# Altium project breakout_brd_raton_v0.PrjPcb
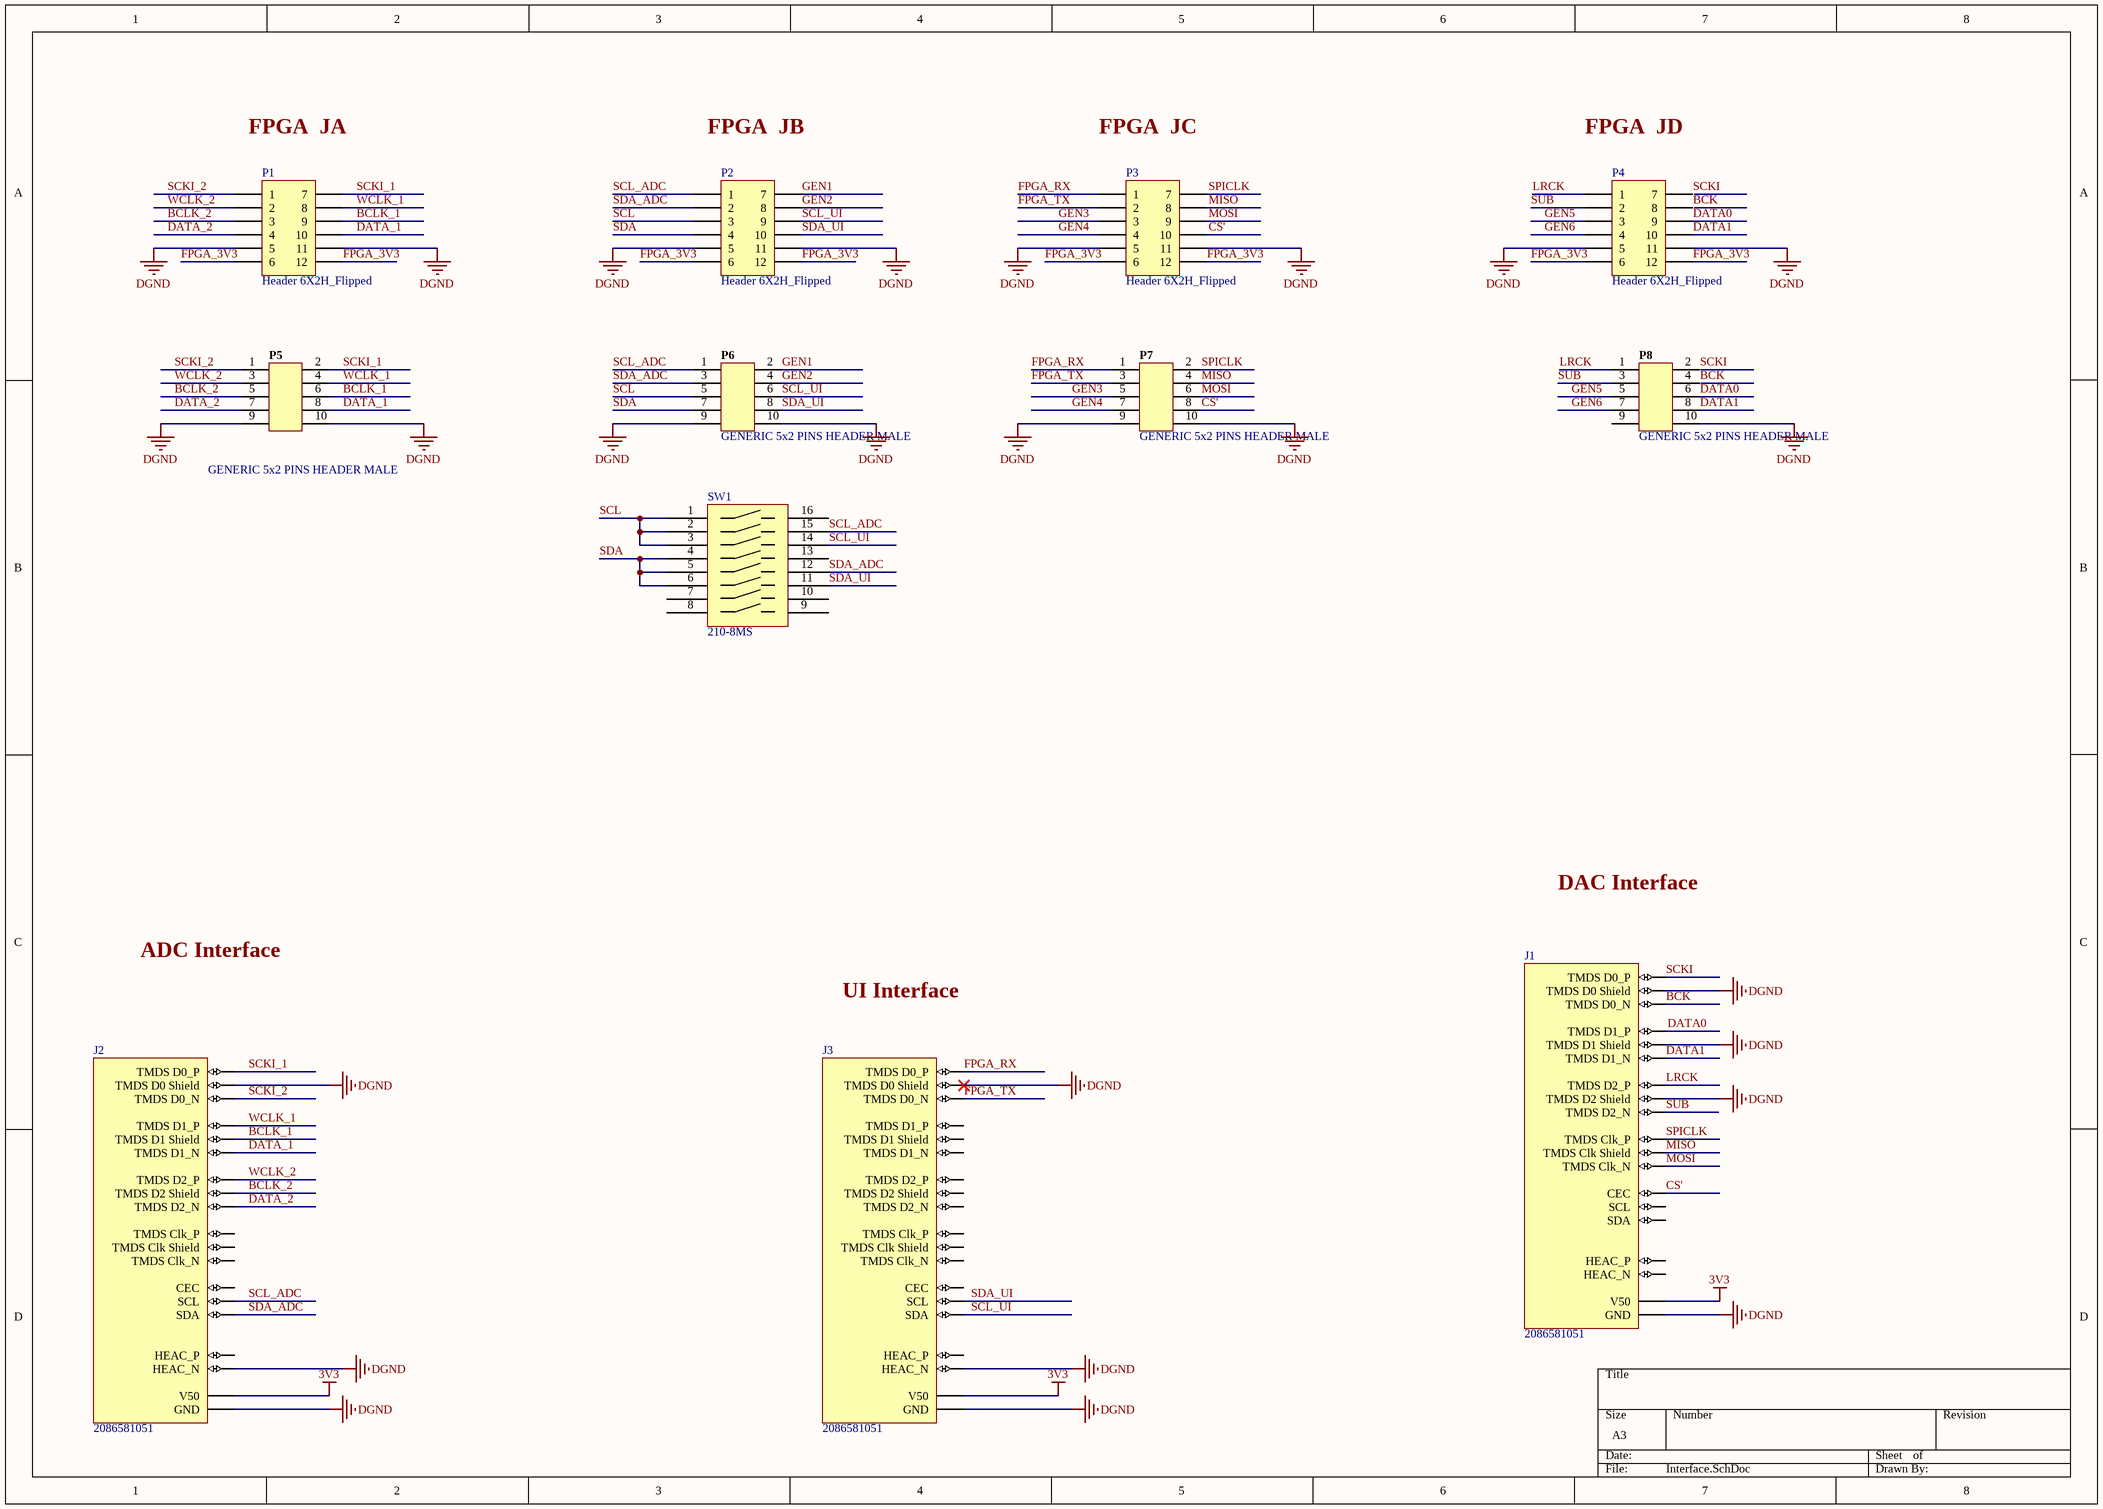
[diagram p0: Interface.SchDoc]
1 sheet, 12 parts. Net scope: global (net labels, ports and power ports of the same name join across sheets).
Board file: breakout_brd_v0.PcbDoc

## Sheet Interface.SchDoc
size A3

### Parts
J1  2086581051  [2086581051]
J2  2086581051  [2086581051]
J3  2086581051  [2086581051]
P1  Header 6X2H_Flipped  [HDR2X6H_Flipped]
P2  Header 6X2H_Flipped  [HDR2X6H_Flipped]
P3  Header 6X2H_Flipped  [HDR2X6H_Flipped]
P4  Header 6X2H_Flipped  [HDR2X6H_Flipped]
P5  GENERIC 5x2 PINS HEADER MALE  [GENERIC 5PIN 2ROW HEADER 0]
P6  GENERIC 5x2 PINS HEADER MALE  [GENERIC 5PIN 2ROW HEADER 0]
P7  GENERIC 5x2 PINS HEADER MALE  [GENERIC 5PIN 2ROW HEADER 0]
P8  GENERIC 5x2 PINS HEADER MALE  [GENERIC 5PIN 2ROW HEADER 0]
SW1  210-8MS  [210-8MS]

### Nets
3V3: J1.18(V50) J2.18(V50) J3.18(V50)
DGND: J1.2(TMDS_D2_Shield) J1.5(TMDS_D1_Shield) J1.8(TMDS_D0_Shield) J1.17(GND) J2.8(TMDS_D0_Shield) J2.17(GND) J2.19(HEAC_N) J3.8(TMDS_D0_Shield) J3.17(GND) J3.19(HEAC_N) P1.5 P1.11 P2.5 P2.11 P3.5 P3.11 P4.5 P4.11 P5.9 P5.10 P6.9 P6.10 P7.9 P7.10 P8.10
BCK: J1.9(TMDS_D0_N) P4.8 P8.4
BCLK_1: J2.5(TMDS_D1_Shield) P1.9 P5.6
BCLK_2: J2.2(TMDS_D2_Shield) P1.3 P5.5
CS': J1.13(CEC) P3.10 P7.8
DATA0: J1.4(TMDS_D1_P) P4.9 P8.6
DATA1: J1.6(TMDS_D1_N) P4.10 P8.8
DATA_1: J2.6(TMDS_D1_N) P1.10 P5.8
DATA_2: J2.3(TMDS_D2_N) P1.4 P5.7
FPGA_3V3: P1.6 P1.12 P2.6 P2.12 P3.6 P3.12 P4.6 P4.12
FPGA_RX: J3.7(TMDS_D0_P) P3.1 P7.1
FPGA_TX: J3.9(TMDS_D0_N) P3.2 P7.3
GEN1: P2.7 P6.2
GEN2: P2.8 P6.4
GEN3: P3.3 P7.5
GEN4: P3.4 P7.7
GEN5: P4.3 P8.5
GEN6: P4.4 P8.7
LRCK: J1.1(TMDS_D2_P) P4.1 P8.1
MISO: J1.11(TMDS_Clk_Shield) P3.8 P7.4
MOSI: J1.12(TMDS_Clk_N) P3.9 P7.6
SCKI: J1.7(TMDS_D0_P) P4.7 P8.2
SCKI_1: J2.7(TMDS_D0_P) P1.7 P5.2
SCKI_2: J2.9(TMDS_D0_N) P1.1 P5.1
SCL: P2.3 P6.5 SW1.1(SW1) SW1.2(SW2) SW1.3(SW3)
SCL_ADC: J2.15(SCL) P2.1 P6.1 SW1.15(SW2.in)
SCL_UI: J3.16(SDA) P2.9 P6.6 SW1.14(SW3.in)
SDA: P2.4 P6.7 SW1.4(SW4) SW1.5(SW1) SW1.6(SW2)
SDA_ADC: J2.16(SDA) P2.2 P6.3 SW1.12(SW1.in)
SDA_UI: J3.15(SCL) P2.10 P6.8 SW1.11(SW2.in)
SPICLK: J1.10(TMDS_Clk_P) P3.7 P7.2
SUB: J1.3(TMDS_D2_N) P4.2 P8.3
WCLK_1: J2.4(TMDS_D1_P) P1.8 P5.4
WCLK_2: J2.1(TMDS_D2_P) P1.2 P5.3

Not connected (* = marked no-connect by the designer): J1 14(HEAC_P) 15(SCL) 16(SDA) 19(HEAC_N); J2 10(TMDS_Clk_P) 11(TMDS_Clk_Shield) 12(TMDS_Clk_N) 13(CEC) 14(HEAC_P); J3 1(TMDS_D2_P) 2(TMDS_D2_Shield) 3(TMDS_D2_N) 4(TMDS_D1_P) 5(TMDS_D1_Shield) 6(TMDS_D1_N) 10(TMDS_Clk_P) 11(TMDS_Clk_Shield) 12(TMDS_Clk_N) 13(CEC) 14(HEAC_P); P8 9; SW1 7 8(SW4) 9(SW4.in) 10(SW3.in) 13(SW4.in) 16(SW1)

### Notes on the sheet
- FPGA  JA
- FPGA  JB
- FPGA  JC
- FPGA  JD
- DAC Interface
- ADC Interface
- UI Interface

### Library data of the parts
J1-J3 = 2086581051-2: CONN FEM SMD 19 90Deg HDMI; Manufacturer: Molex; Status: Active; Supplier 1: Mouser; Source: Connector Library.SchLib; Design Item ID: 2086581051; Bin: *; Supplier Part Number 1: Mouser; Type: HYBRID; Case/Package: 4 PIN
P1-P4 = Header 6X2H_Flipped-1: Header, 6-Pin, Dual row, Right Angle, Flipped; Type: TH; Case/Package: 6 PIN; Source: Connector Library.SchLib; Design Item ID: Header 6X2H_Flipped
P5-P8 = GENERIC 5x2 PINS HEADER MALE-2: CONN MAL TH 5x2 0Deg HEADER; Bin: B3-J5; Status: Active; Case/Package: 2 PIN; Source: Connector Library.SchLib; Type: TH; Design Item ID: GENERIC 5x2 PINS HEADER MALE; Manufacturer: Generic
SW1 = 210-8MS-2: SWITCH DIP SMD SPST 8 100mA 50V; Manufacturer: C&K Components; Supplier Part Number 1: 774-2108MS; Design Item ID: 210-8MS; Source: Switches Library.SchLib; Case/Package: 16 PDIP; Supplier 1: Mouser; Status: Active; Type: TH